# Altium schematic sheet Sensor.SchDoc
size A4; SheetNumber: 6; SheetTotal: 6
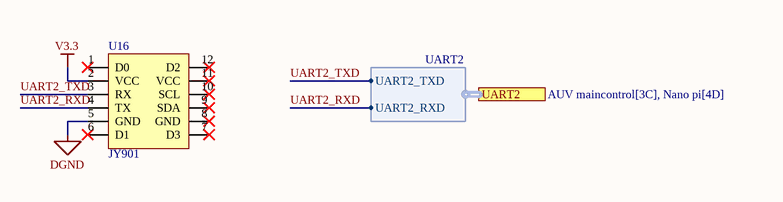
[diagram p0: Sensor.SchDoc]

## Parts
U16  JY901  [9轴模块(简易版)]

## Ports
UART2 (harness UART2, see AUV maincontrol[3C], Nano pi[4D])

## Harnesses
UART2: UART2_TXD, UART2_RXD

## Nets
DGND: U16.5(GND)
V3.3: U16.2(VCC)
UART2_RXD: U16.4(TX) ; port UART2.UART2_RXD
UART2_TXD: U16.3(RX) ; port UART2.UART2_TXD

Not connected (* = marked no-connect by the designer): U16 1(D0)* 6(D1)* 7(D3)* 8(GND)* 9(SDA)* 10(SCL)* 11(VCC)* 12(D2)*

## Library data of the parts
U16 = 9轴加速度计